# EAGLE schematic gripper-board-rev1 (EAGLE 6.5.0)
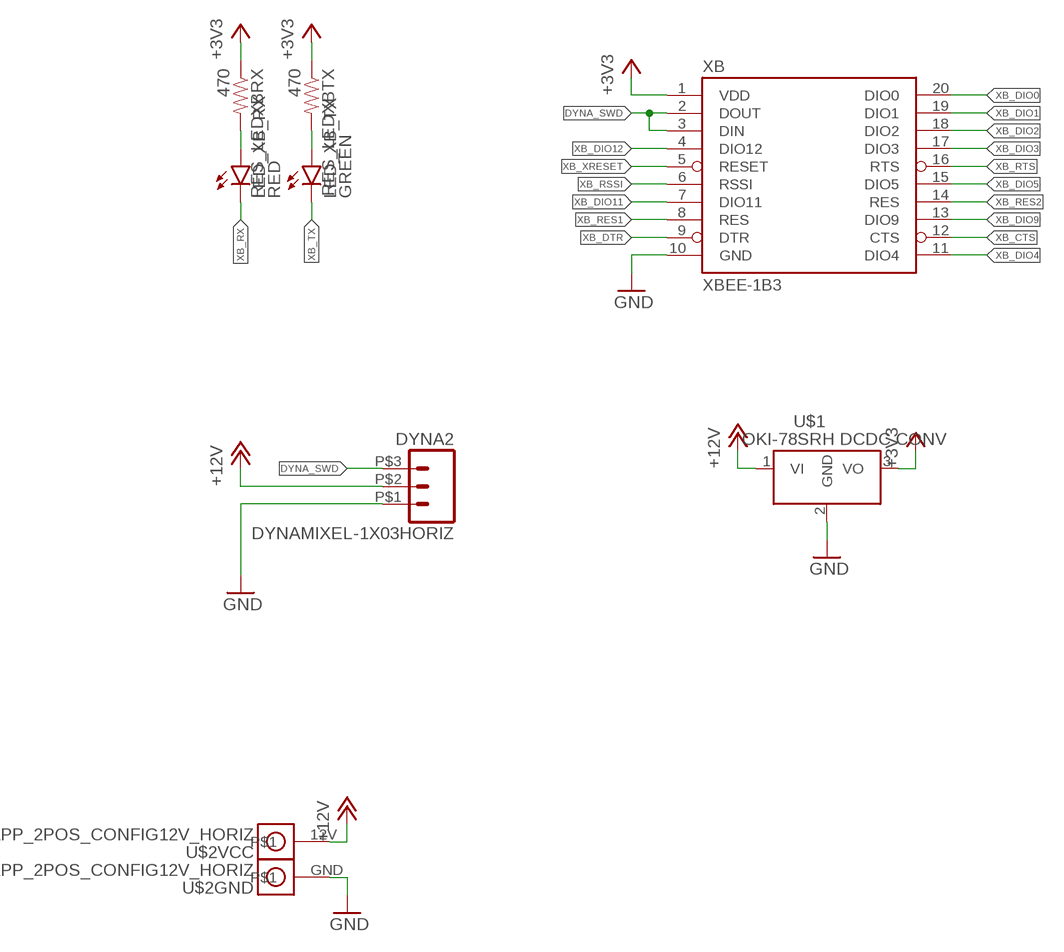
[diagram p0: schematic, sheet 1]

## Parts
DYNA2  DYNAMIXEL-1X03HORIZ  [MLX-SPOX5268-3PIN]
LED_XB_RX  RED  LED1206  [LED-1206]
LED_XB_TX  GREEN  LED-GREEN1206  [LED-1206]
RES_LEDXBRX  470  RESISTOR1206  [1206]
RES_LEDXBTX  470  RESISTOR1206  [1206]
U$1  Q_OKI-78SR  [OKI-78SRH]
U$2  APP_2POS_CONFIG12V_HORIZ  [APP45_12V_HORIZ_CONFIG]
XB  XBEE-1B3  [XBEE-SMD]

## Nets
+3V3: RES_LEDXBRX.1 RES_LEDXBTX.1 U$1.3(VO) XB.1(VDD)
+12V: DYNA2.P$2 U$1.1(VI) U$2.12V
DYNA_SWD: DYNA2.P$3 XB.2(DOUT) XB.3(DIN)
GND: DYNA2.P$1 U$1.2(GND) U$2.GND XB.10(GND)
N$1: LED_XB_RX.A RES_LEDXBRX.2
N$2: LED_XB_TX.A RES_LEDXBTX.2
XB_CTS: XB.12(CTS)
XB_DIO0: XB.20(DIO0)
XB_DIO1: XB.19(DIO1)
XB_DIO2: XB.18(DIO2)
XB_DIO3: XB.17(DIO3)
XB_DIO4: XB.11(DIO4)
XB_DIO5: XB.15(DIO5)
XB_DIO9: XB.13(DIO9)
XB_DIO11: XB.7(DIO11)
XB_DIO12: XB.4(DIO12)
XB_DTR: XB.9(DTR)
XB_RES1: XB.8(RES)
XB_RES2: XB.14(RES)
XB_RSSI: XB.6(RSSI)
XB_RTS: XB.16(RTS)
XB_RX: LED_XB_RX.C
XB_TX: LED_XB_TX.C
XB_XRESET: XB.5(RESET)

## Library data of the parts
DYNA2 = MRDT-2015-Arm:DYNAMIXEL-1X03; MFR: Molex; MFR_PN: 0022057035; ORIENT: Horiz
LED_XB_RX = SparkFun-LED:LED: LEDs Standard schematic elements and footprints for 5mm, 3mm, 1206, and 0603 sized LEDs. 5mm - Spark Fun Electronics SKU : COM-00529 (and others)
LED_XB_TX = SparkFun-LED:LED-GREEN: Various green LEDs Green LEDs used in SFE Production 0603- DIO-00821 LARGE- DIO-00862 LILYPAD- DIO-09910; PROD_ID: DIO-00862
RES_LEDXBRX RES_LEDXBTX = SparkFun-Passives:RESISTOR: Resistor Basic schematic elements and footprints for 0603, 1206, and PTH resistors.
U$1 = MRDT-2015-PowerBoard:Q_OKI-78SR: 4.95W DC/DC Converter Manufacturer: Murata Part Number: OKI-78SR-5/1.5-W36H-C OKI-78SR-3.3/1.5-W36H-C
U$2 = MRDT-Connectors:APP_2POS_CONFIG; COLOR1: YELLOW; COLOR2: BLACK
XB = SparkFun:XBEE-1